# EAGLE schematic dedo_rev_1_2 (EAGLE 9.4.2)
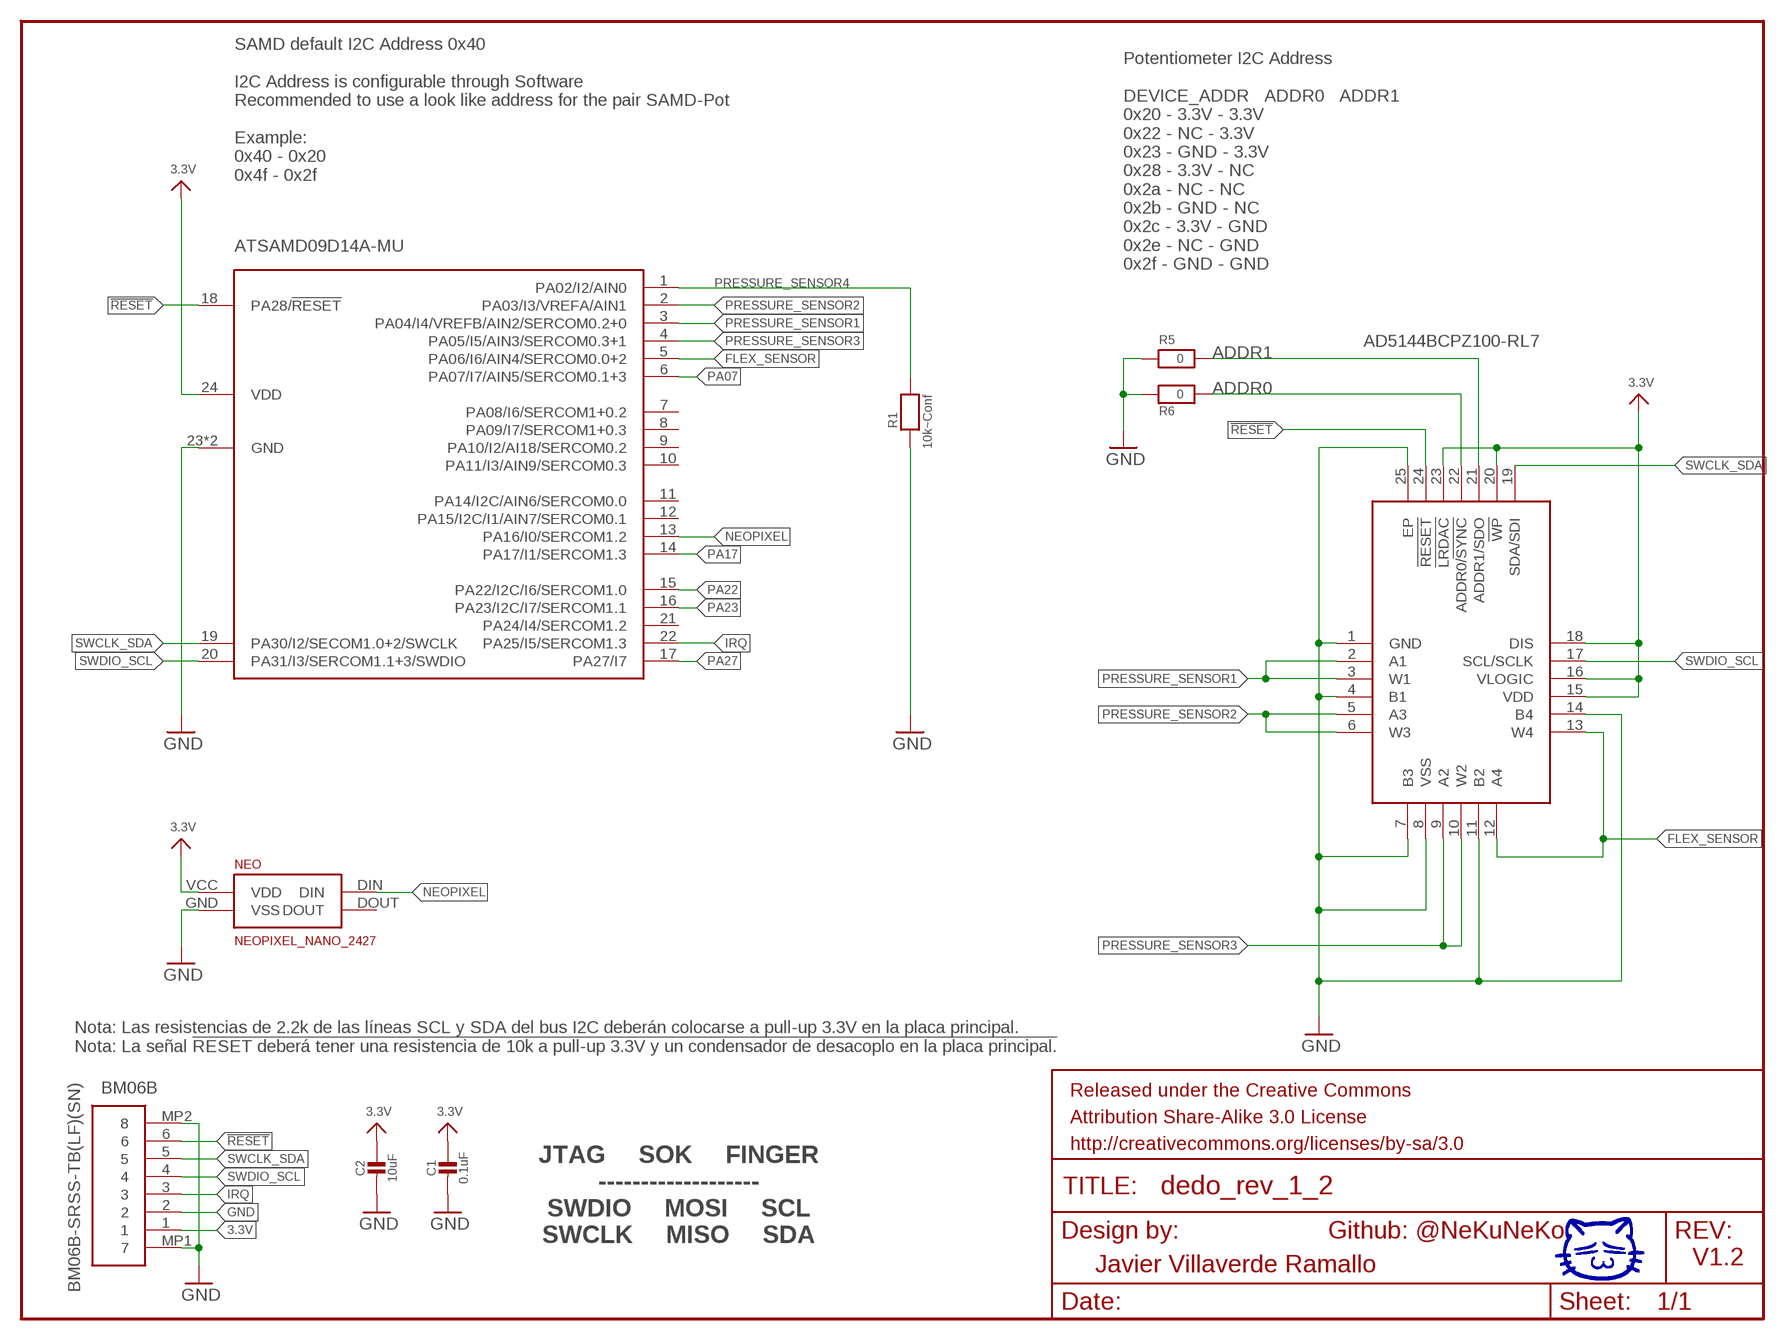
[diagram p0: schematic, sheet 1]

## Parts
AD5144BCPZ100  AD5144BCPZ100-RL7  [QFN50P400X400X80-25N]
BM06B  BM06B-SRSS-TB(LF)(SN)  [BM06BSRSSTBLFSN]
C1  0.1uF  CAP_CERAMIC0402  [0402]
C2  10uF  CAP_CERAMIC0402  [0402]
FRAME1  FRAME-LETTER  [CREATIVE_COMMONS]
FRAME2  FRAME-LETTER  [CREATIVE_COMMONS]
NEO  NEOPIXEL_NANO_2427  [SK6805-2427]
R1  10k~Conf  RESISTOR_0402  [_0402]
R5  0  RESISTOR_0402  [_0402]
R6  0  RESISTOR_0402  [_0402]
SAMD09  ATSAMD09D14A-MU  [QFN24_4MM]

## Nets
3.3V: AD5144BCPZ100.15(VDD) AD5144BCPZ100.16(VLOGIC) AD5144BCPZ100.18(DIS) AD5144BCPZ100.20(!WP) AD5144BCPZ100.23(!LRDAC) BM06B.1 C1.1 C2.1 NEO.VCC(VDD) SAMD09.24(VDD)
!RESET: AD5144BCPZ100.24(!RESET) BM06B.6 SAMD09.18(PA28/!RESET)
ADDR0: AD5144BCPZ100.22(ADDR0/!SYNC) R6.2
ADDR1: AD5144BCPZ100.21(ADDR1/SDO) R5.2
FLEX_SENSOR: AD5144BCPZ100.12(A4) AD5144BCPZ100.13(W4) SAMD09.5(PA06/I6/AIN4/SERCOM0.0+2)
GND: AD5144BCPZ100.1(GND) AD5144BCPZ100.4(B1) AD5144BCPZ100.7(B3) AD5144BCPZ100.8(VSS) AD5144BCPZ100.11(B2) AD5144BCPZ100.14(B4) AD5144BCPZ100.25(EP) BM06B.2 BM06B.MP1 BM06B.MP2 C1.2 C2.2 NEO.GND(VSS) R1.2 R5.1 R6.1 SAMD09.23(GND) SAMD09.THERM(GND)
IRQ: BM06B.3 SAMD09.22(PA25/I5/SERCOM1.3)
NEOPIXEL: NEO.DIN SAMD09.13(PA16/I0/SERCOM1.2)
PA07: SAMD09.6(PA07/I7/AIN5/SERCOM0.1+3)
PA17: SAMD09.14(PA17/I1/SERCOM1.3)
PA22: SAMD09.15(PA22/I2C/I6/SERCOM1.0)
PA23: SAMD09.16(PA23/I2C/I7/SERCOM1.1)
PA27: SAMD09.17(PA27/I7)
PRESSURE_SENSOR1: AD5144BCPZ100.2(A1) AD5144BCPZ100.3(W1) SAMD09.3(PA04/I4/VREFB/AIN2/SERCOM0.2+0)
PRESSURE_SENSOR2: AD5144BCPZ100.5(A3) AD5144BCPZ100.6(W3) SAMD09.2(PA03/I3/VREFA/AIN1)
PRESSURE_SENSOR3: AD5144BCPZ100.9(A2) AD5144BCPZ100.10(W2) SAMD09.4(PA05/I5/AIN3/SERCOM0.3+1)
PRESSURE_SENSOR4: R1.1 SAMD09.1(PA02/I2/AIN0)
SWCLK_SDA: AD5144BCPZ100.19(SDA/SDI) BM06B.5 SAMD09.19(PA30/I2/SECOM1.0+2/SWCLK)
SWDIO_SCL: AD5144BCPZ100.17(SCL/SCLK) BM06B.4 SAMD09.20(PA31/I3/SERCOM1.1+3/SWDIO)
Unconnected: NEO.DOUT SAMD09.7(PA08/I6/SERCOM1+0.2) SAMD09.8(PA09/I7/SERCOM1+0.3) SAMD09.9(PA10/I2/AI18/SERCOM0.2) SAMD09.10(PA11/I3/AIN9/SERCOM0.3) SAMD09.11(PA14/I2C/AIN6/SERCOM0.0) SAMD09.12(PA15/I2C/I1/AIN7/SERCOM0.1) SAMD09.21(PA24/I4/SERCOM1.2)

## Notes on the sheet
- SAMD default I2C Address 0x40
  
  I2C Address is configurable through Software
  Recommended to use a look like address for the pair SAMD-Pot
  
  Example: 
  0x40 - 0x20
  0x4f - 0x2f
- Potentiometer I2C Address
  
  DEVICE_ADDR   ADDR0   ADDR1   
  0x20 - 3.3V - 3.3V 
  0x22 - NC - 3.3V
  0x23 - GND - 3.3V
  0x28 - 3.3V - NC
  0x2a - NC - NC
  0x2b - GND - NC 
  0x2c - 3.3V - GND
  0x2e - NC - GND
  0x2f - GND - GND
- Nota: Las resistencias de 2.2k de las líneas SCL y SDA del bus I2C deberán colocarse a pull-up 3.3V en la placa principal.
  Nota: La señal !RESET deberá tener una resistencia de 10k a pull-up 3.3V y un condensador de desacoplo en la placa principal.
- JTAG ⇆ SOK ⇆ FINGER
  -------------------
  SWDIO ⇆ MOSI ⇆ SCL
  SWCLK ⇆ MISO ⇆ SDA
- Github: @NeKuNeKo
- V1.2
- Javier Villaverde Ramallo

## Library data of the parts
AD5144BCPZ100 = SamacSys_Parts:AD5144BCPZ100-RL7: ANALOG DEVICES - AD5144BCPZ100-RL7 - DIGITAL POT, 100KOHM, QUAD, LFCSP-24 Source: Datasheet <http://www.analog.com/media/en/technical-documentation/data-sheets/AD5124_5144_5144A.pdf>; DESCRIPTION: ANALOG DEVICES - AD5144BCPZ100-RL7 - DIGITAL POT, 100KOHM, QUAD, LFCSP-24; HEIGHT: 0.8mm; MANUFACTURER_NAME: Analog Devices; MANUFACTURER_PART_NUMBER: AD5144BCPZ100-RL7; MOUSER_PART_NUMBER: 584-AD5144BCPZ100-R7; MOUSER_PRICE-STOCK: https://www.mouser.com/Search/Refine.aspx?Keyword=584-AD5144BCPZ100-R7
BM06B = 0SoK:BM06B-SRSS-TB(LF)(SN): connector,multipole PCB use,BM06B-SRSS-T JST SH Series, 1mm Pitch 6 Way 1 Row Straight PCB Header, Solder Termination, 1A Source: Datasheet <http://docs-emea.rs-online.com/webdocs/13ce/0900766b813ce45e.pdf>; DESCRIPTION: connector,multipole PCB use,BM06B-SRSS-T JST SH Series, 1mm Pitch 6 Way 1 Row Straight PCB Header, Solder Termination, 1A; HEIGHT: 4.25mm; MANUFACTURER_NAME: JST (JAPAN SOLDERLESS TERMINALS); MANUFACTURER_PART_NUMBER: BM06B-SRSS-TB(LF)(SN); RS_PART_NUMBER: 5468782; RS_PRICE-STOCK: https://uk.rs-online.com/web/p/products/5468782
C1 C2 = microbuilder:CAP_CERAMIC: Ceramic Capacitors 0402 - 0402 Surface Mount Capacitors 16pF 50V 5% [Digikey: 445-4899-2-ND] 18pF 50V 5% [Digikey: 490-1281-2-ND] 22pF 50V 5% [Digikey: 490-1283-2-ND] 68pF 50V 5% [Digikey: 490-1289-2-ND] 0.1uF 10V 10% [Digikey: 490-1318-2-ND] 1.0uF 6.3V 10% [Digikey: 490-1320-2-ND] 0603 - 0603 Surface Mount Capacitors 16 pF 50V 5% [Digikey: 445-5051-2-ND] 22 pF 50V [Digikey: PCC220ACVTR-ND] 33 pF 50V 5% [Digikey: 490-1415-1-ND] 56pF 50V 5% [Digikey: 490-1421-1-ND] 220pF 50V 5% [Digikey: 445-1285-1-ND] 680 pF 50V 2200 pF 50V 5% C0G [Digikey: 445-1297-1-ND] 5600 pF 100V 5% X7R [Digikey: 478-3711-1-ND] 0.1 µF 25V 10% [Digikey: PCC2277TR-ND] 0.22 µF 16V 10% X7R [Digikey: 445-1318-1-ND] 1.0 µF 25V 10% [Digikey: 445-5146-2-ND] 0603 - RF Specific 3pF 250V +/-0.1pF RF [Digikey: 712-1347-1-ND] 18 pF 250V 5% [Digikey: 478-3505-1-ND or 712-1322-1-ND] 56 pF 250V 5% C0G RF [Digikey: 490-4867-1-ND] 68 pF 250V RF [Digikey: 490-4868-1-ND] 0805 - 0805 Surface Mount Capacitors 220 pF 250V 2% RF Ceramic Capacitor [Digikey: 712-1398-1-ND] 1000 pF 50V 2% NP0 Ceramic Capacitor [Digikey: 478-3760-1-ND] 0.1 µF 25V 10% Ceramic Capacitor [Digikey: PCC1828TR-ND] 1.0 µF 16V 10% Ceramic Capacitor[Digikey: 490-1691-2-ND] 10.0 µF 10V 10% Ceramic Capacitor[Digikey: 709-1228-1-ND] 10.0 uF 16V 10% Ceramic Capacitor [Digikey: 478-5165-2-ND] 47 uF 6.3V 20% Ceramic Capacitor [Digikey: 587-1779-1-ND or 399-5506-1-ND] 1206 - 1206 Surface Mount Capacitors 47uF 10V 20% Ceramic Capacitor [Digikey: 490-5528-1-ND or 399-5508-1-ND or 445-6010-1-ND] 100uF 6.3V -20%, +80% Y5V Ceramic Capacitor (Digikey: 490-4512-1-ND, Mouser: 81-GRM31CF50J107ZE1L)
FRAME1 FRAME2 = SparkFun-Aesthetics:FRAME-LETTER: Schematic Frame Standard 8.5x11 US Letter frame
NEO = NeoPixel Nano 2427:NEOPIXEL_NANO_2427
R1 R5 R6 = microbuilder:RESISTOR: Resistors 0402 - 0402 Surface Mount Package 22 Ohm 1% 1/16W [Digikey: 311-22.0LRTR-ND] 33 Ohm 5% 1/16W 1.0K 5% 1/16W 1.5K 5% 1/16W 2.0K 1% 1/16W 10.0K 1% 1/16W [Digikey: 311-10.0KLRTR-ND] 10.0K 5% 1/16W [Digikey: RMCF0402JT10K0TR-ND] 12.1K 1% 1/16W [Digikey: 311-22.0LRTR-ND] 100.0K 5% 1/16W 0603 - 0603 Surface Mount Package 0 Ohm 1/10 Watt 1% Resistor 15 Ohm 1/10 Watt 1% Resistor 33 Ohm 1/10 Watt 1% Resistor 49.9 Ohm 1/10 Watt 1% Resistor 100 Ohm 1/10 Watt 1% Resistor 150 Ohm 1/10 Watt 1% Resistor 240 Ohm 1/10 Watt 1% Resistor 390 Ohm 1/10 Watt 1% Resistor 560 Ohm 1/10 Watt 1% Resistor 680 Ohm 1/10 Watt 1% Resistor 750 Ohm 1/10 Watt 1% Resistor 1.0K Ohm 1/10 Watt 1% Resistor 1.5K Ohm 1/10 Watt 1% Resistor 2.0K Ohm 1/10 Watt 1% Resistor 2.2K Ohm 1/10 Watt 1% Resistor 3.3K Ohm 1/10 Watt 1% Resistor 4.7K Ohm 1/10 Watt 1% Resistor 10.0K Ohm 1/10 Watt 1% Resistor 12.0K Ohm 1/10 Watt 1% Resistor 12.1K Ohm 1/10 Watt 1% Resistor 20.0K Ohm 1/10 Watt 1% Resistor 33.0K Ohm 1/10 Watt 1% Resistor 100.0K Ohm 1/10 Watt 1% Resistor 0805 - 0805 Surface Mount Package 0 Ohm 1/8 Watt 1% Resistor 33 Ohm 1/8 Watt 1% Resistor 100 Ohm 1/8 Watt 1% Resistor 150 Ohm 1/8 Watt 1% Resistor 200 Ohm 1/8 Watt 1% Resistor 240 Ohm 1/8 Watt 1% Resistor 330 Ohm 1/8 Watt 1% Resistor 390 Ohm 1/8 Watt 1% Resistor 470 Ohm 1/8 Watt 1% Resistor 1.0K Ohm 1/8 Watt 1% Resistor 1.5K Ohm 1/8 Watt 1% Resistor 2.0K Ohm 1/8 Watt 1% Resistor 4.7K Ohm 1/8 Watt 1% Resistor 5.1K Ohm 1/8 Watt 1% Resistor 5.6K Ohm 1/8 Watt 1% Resistor 10.0K Ohm 1/8 Watt 1% Resistor 22.0K Ohm 1/8 Watt 1% Resistor 33.0K Ohm 1/8 Watt 1% Resistor 100K Ohm 1/8 Watt 1% Resistor 1206 - 1206 Surface Mount Package 2012 - 2010 Surface Mount Package 0.11 Ohm 1/2 Watt 1% Resistor - Digikey: RHM.11UCT-ND
SAMD09 = microbuilder:ATSAMD09D14A